# Altium project PCB_Project.PrjPcb
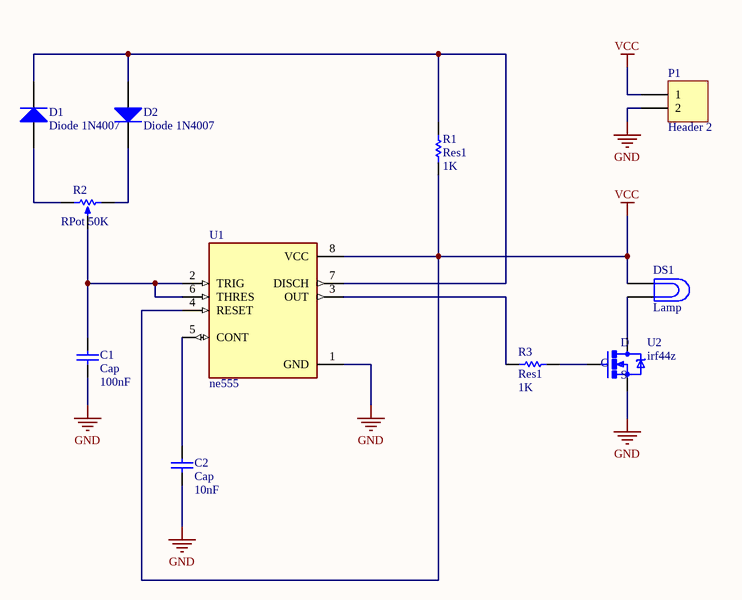
[diagram p0: ne555dimmer.SchDoc]
1 sheet, 11 parts. Net scope: global (net labels, ports and power ports of the same name join across sheets).
Board file: ne555dimmer.PcbDoc

## Sheet ne555dimmer.SchDoc
size A4; SheetNumber: 1; SheetTotal: 1

### Parts
C1  Cap  value 100nF  [RAD-0.3]
C2  Cap  value 10nF  [RAD-0.3]
D1  Diode 1N4007  [DO-41]
D2  Diode 1N4007  [DO-41]
DS1  Lamp  [PIN2]
P1  Header 2  [HDR1X2]
R1  Res1  value 1K  [AXIAL-0.3]
R2  RPot  value 50K  [VR5]
R3  Res1  value 1K  [AXIAL-0.3]
U1  ne555  [ne555]
U2  irf44z  [ırfz44]

### Nets
GND: C1.1 C2.1 P1.2 U1.1(GND) U2.3(S)
VCC: DS1.1 P1.1 R1.1 U1.4(RESET) U1.8(VCC)
NetC1_2: C1.2 R2.3(TAP) U1.2(TRIG) U1.6(THRES)
NetC2_2: C2.2 U1.5(CONT)
NetD1_1: D1.1(A) R2.1(TOP)
NetD1_2: D1.2(K) D2.1(A) R1.2 U1.7(DISCH)
NetD2_2: D2.2(K) R2.2(BOT)
NetDS1_2: DS1.2 U2.2(D)
NetR3_1: R3.1 U1.3(OUT)
NetR3_2: R3.2 U2.1(G)

### Library data of the parts
C1 C2 = Cap: Capacitor; Published: 8-Jun-2000; LatestRevisionDate: 17-Jul-2002; LatestRevisionNote: Re-released for DXP Platform.; PackageReference: RAD-0.3; Publisher: Altium Limited; PackageDescription: Radial Cap, Thru-Hole; 2 Leads; 0.3 in Pin Spacing
D1 D2 = Diode 1N4007: 1 Amp General Purpose Rectifier; Published: 8-Jun-2000; LatestRevisionDate: 17-Jul-2002; LatestRevisionNote: Re-released for DXP Platform.; DatasheetVersion: 1998; PackageVersion: Aug-1999; PackageReference: DO-41; Publisher: Altium Limited; PackageDescription: Diode, Axial; Body 5.2 x 2.7 mm (LxDia. max), Lead Dia. 0.86 mm (max); Code_JEDEC: DO-204-AL; ComponentLink1Description: Manufacturer Link; ComponentLink1URL: http://www.fairchildsemi.com/; ComponentLink2Description: Datasheet; ComponentLink2URL: http://www.fairchildsemi.com/ds/1N%2F1N4001.pdf
DS1 = Lamp: Incandescent Bulb; Published: 24-Mar-1999; LatestRevisionDate: 17-Jul-2002; LatestRevisionNote: Re-released for DXP Platform.; PackageReference: PIN2; Publisher: Altium Limited
P1 = Header 2: Header, 2-Pin; LatestRevisionDate: 17-Jul-2002; LatestRevisionNote: Re-released for DXP Platform.; Publisher: Altium Limited
R1 R3 = Res1: Resistor; Published: 8-Jun-2000; LatestRevisionDate: 17-Jul-2002; LatestRevisionNote: Re-released for DXP Platform.; PackageReference: AXIAL-0.3; Publisher: Altium Limited; PackageDescription: Axial Device, Thru-Hole; 2 Leads; 0.3 in Pin Spacing
R2 = RPot: Potentiometer; Sim Note: Enter the Resistance value and the set point into parameter fields.; Set Position: 0.5; Published: 8-Jun-2000; LatestRevisionDate: 17-Jul-2002; LatestRevisionNote: Re-released for DXP Platform.; PackageReference: VR5; Publisher: Altium Limited; PackageDescription: Variable Resistor, Thru-Hole; 3 Leads